# Altium schematic sheet Temp_sensors Input.SchDoc
size A4; SheetNumber: 10; SheetTotal: 16
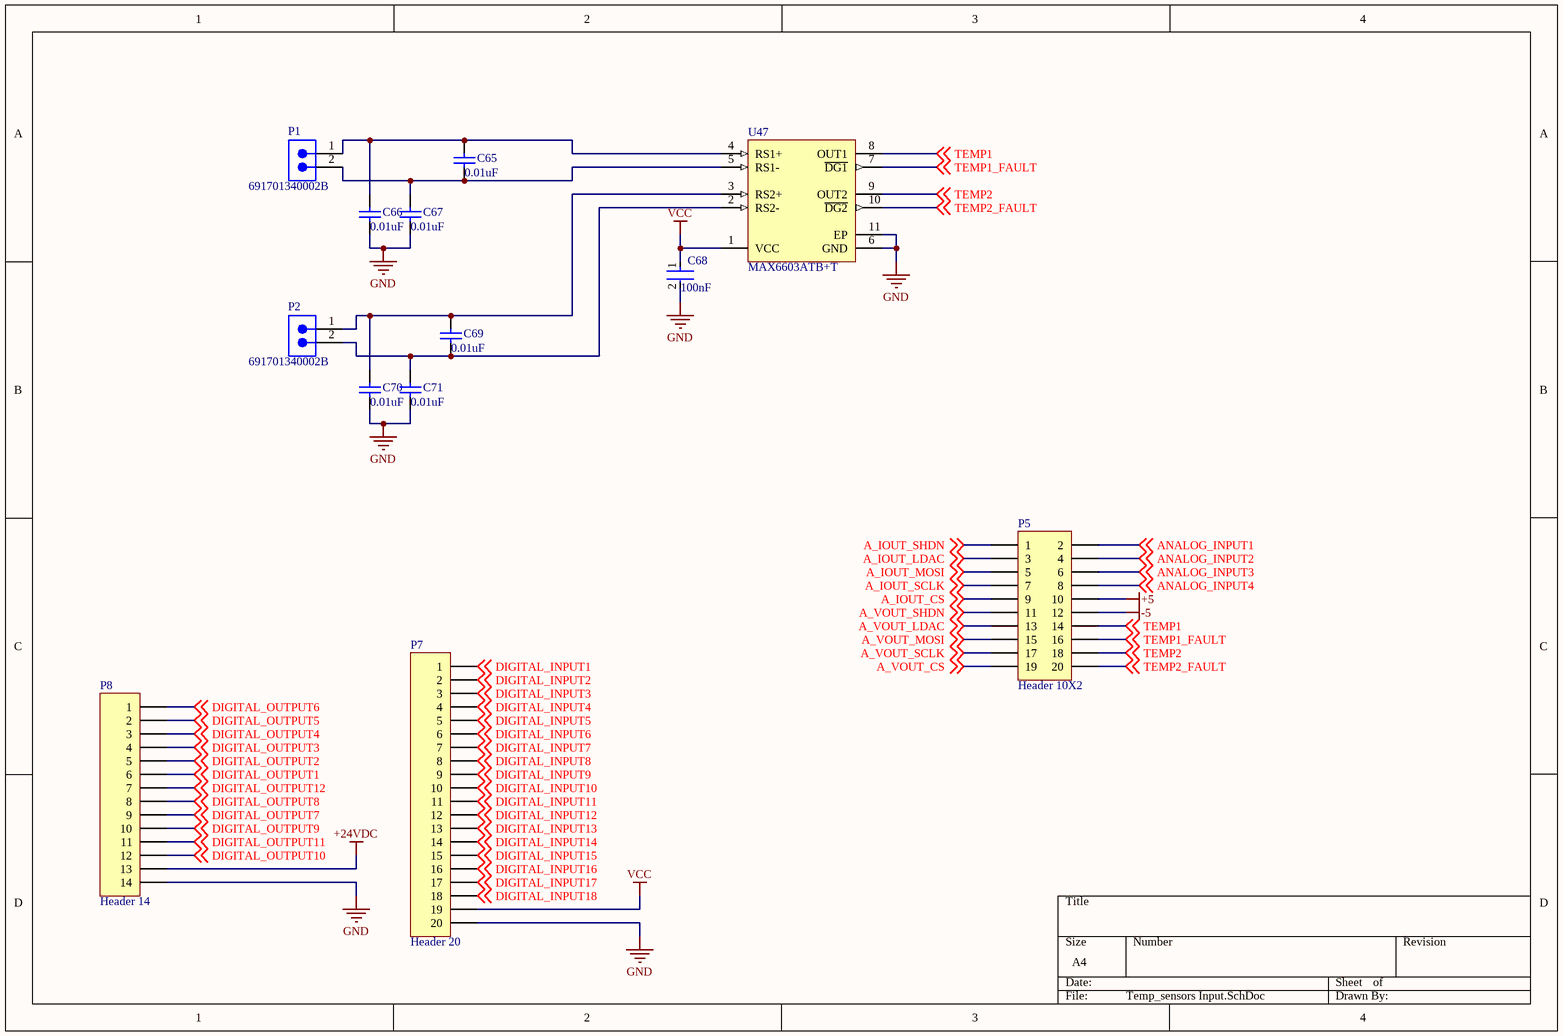
[diagram p0: Temp_sensors Input.SchDoc]

## Parts
C65  value 0.01uF  [CAPC1608X92X38ML15T08]  (hidden comment: VJ0603Y103KXAAP)
C66  value 0.01uF  [CAPC1608X92X38ML15T08]  (hidden comment: VJ0603Y103KXAAP)
C67  value 0.01uF  [CAPC1608X92X38ML15T08]  (hidden comment: VJ0603Y103KXAAP)
C68  Capacitance: 100nF  [FP-0805-L_2_01_0_2-W_1_25-IPC_B]  (hidden comment: 08051C104K4T2A)
C69  value 0.01uF  [CAPC1608X92X38ML15T08]  (hidden comment: VJ0603Y103KXAAP)
C70  value 0.01uF  [CAPC1608X92X38ML15T08]  (hidden comment: VJ0603Y103KXAAP)
C71  value 0.01uF  [CAPC1608X92X38ML15T08]  (hidden comment: VJ0603Y103KXAAP)
P1  691701340002B  [691701340002B]
P2  691701340002B  [691701340002B]
P5  Header 10X2  [HDR2X10]
P7  Header 20  [HDR1X20]
P8  Header 14  [HDR1X14]
U47  MAX6603ATB+T  [MAXM-T1033+1_V]

## Nets
+5: P5.10
+24VDC: P8.13
-5: P5.12
GND: C66.1 C67.1 C68.2 C70.1 C71.1 P7.20 P8.14 U47.6(GND) U47.11(EP)
VCC: C68.1 P7.19 U47.1(VCC)
A_IOUT_CS: P5.9 ; off-sheet A_IOUT_CS
A_IOUT_LDAC: P5.3 ; off-sheet A_IOUT_LDAC
A_IOUT_MOSI: P5.5 ; off-sheet A_IOUT_MOSI
A_IOUT_SCLK: P5.7 ; off-sheet A_IOUT_SCLK
A_IOUT_SHDN: P5.1 ; off-sheet A_IOUT_SHDN
A_VOUT_CS: P5.19 ; off-sheet A_VOUT_CS
A_VOUT_LDAC: P5.13 ; off-sheet A_VOUT_LDAC
A_VOUT_MOSI: P5.15 ; off-sheet A_VOUT_MOSI
A_VOUT_SCLK: P5.17 ; off-sheet A_VOUT_SCLK
A_VOUT_SHDN: P5.11 ; off-sheet A_VOUT_SHDN
ANALOG_INPUT1: P5.2 ; off-sheet ANALOG_INPUT1
ANALOG_INPUT2: P5.4 ; off-sheet ANALOG_INPUT2
ANALOG_INPUT3: P5.6 ; off-sheet ANALOG_INPUT3
ANALOG_INPUT4: P5.8 ; off-sheet ANALOG_INPUT4
DIGITAL_INPUT1: P7.1 ; off-sheet DIGITAL_INPUT1
DIGITAL_INPUT2: P7.2 ; off-sheet DIGITAL_INPUT2
DIGITAL_INPUT3: P7.3 ; off-sheet DIGITAL_INPUT3
DIGITAL_INPUT4: P7.4 ; off-sheet DIGITAL_INPUT4
DIGITAL_INPUT5: P7.5 ; off-sheet DIGITAL_INPUT5
DIGITAL_INPUT6: P7.6 ; off-sheet DIGITAL_INPUT6
DIGITAL_INPUT7: P7.7 ; off-sheet DIGITAL_INPUT7
DIGITAL_INPUT8: P7.8 ; off-sheet DIGITAL_INPUT8
DIGITAL_INPUT9: P7.9 ; off-sheet DIGITAL_INPUT9
DIGITAL_INPUT10: P7.10 ; off-sheet DIGITAL_INPUT10
DIGITAL_INPUT11: P7.11 ; off-sheet DIGITAL_INPUT11
DIGITAL_INPUT12: P7.12 ; off-sheet DIGITAL_INPUT12
DIGITAL_INPUT13: P7.13 ; off-sheet DIGITAL_INPUT13
DIGITAL_INPUT14: P7.14 ; off-sheet DIGITAL_INPUT14
DIGITAL_INPUT15: P7.15 ; off-sheet DIGITAL_INPUT15
DIGITAL_INPUT16: P7.16 ; off-sheet DIGITAL_INPUT16
DIGITAL_INPUT17: P7.17 ; off-sheet DIGITAL_INPUT17
DIGITAL_INPUT18: P7.18 ; off-sheet DIGITAL_INPUT18
DIGITAL_OUTPUT1: P8.6 ; off-sheet DIGITAL_OUTPUT1
DIGITAL_OUTPUT2: P8.5 ; off-sheet DIGITAL_OUTPUT2
DIGITAL_OUTPUT3: P8.4 ; off-sheet DIGITAL_OUTPUT3
DIGITAL_OUTPUT4: P8.3 ; off-sheet DIGITAL_OUTPUT4
DIGITAL_OUTPUT5: P8.2 ; off-sheet DIGITAL_OUTPUT5
DIGITAL_OUTPUT6: P8.1 ; off-sheet DIGITAL_OUTPUT6
DIGITAL_OUTPUT7: P8.9 ; off-sheet DIGITAL_OUTPUT7
DIGITAL_OUTPUT8: P8.8 ; off-sheet DIGITAL_OUTPUT8
DIGITAL_OUTPUT9: P8.10 ; off-sheet DIGITAL_OUTPUT9
DIGITAL_OUTPUT10: P8.12 ; off-sheet DIGITAL_OUTPUT10
DIGITAL_OUTPUT11: P8.11 ; off-sheet DIGITAL_OUTPUT11
DIGITAL_OUTPUT12: P8.7 ; off-sheet DIGITAL_OUTPUT12
TEMP1: P5.14 U47.8(OUT1) ; off-sheet TEMP1
TEMP1_FAULT: P5.16 U47.7(~{DG1}) ; off-sheet TEMP1_FAULT
TEMP2: P5.18 U47.9(OUT2) ; off-sheet TEMP2
TEMP2_FAULT: P5.20 U47.10(~{DG2}) ; off-sheet TEMP2_FAULT
NetC65_1: C65.1 C67.2 P1.2 U47.5(RS1-)
NetC65_2: C65.2 C66.2 P1.1 U47.4(RS1+)
NetC69_1: C69.1 C71.2 P2.2 U47.2(RS2-)
NetC69_2: C69.2 C70.2 P2.1 U47.3(RS2+)

## Library data of the parts
C65-C67 C69-C71 = CMP-2006-01149-1: Manufacturer: Vitramon; Part Number: VJ0603Y103KXAAP
C68 = CMP-2007-04172-2: Automotive Ceramic Capacitor, 0805, 100nF, 10%, X7R, 15%, 100V; Voltage Rating (DC): 100V; Case Code (Metric): 2012; Mount: Surface Mount; Length: 2.01mm; Depth: 1.25mm; Lead Free: Lead Free; Ratings: AEC-Q200; Max Operating Temperature: 125°C; Tolerance: 10%; Case/Package: 0805; Width: 0.049inch; Package Quantity: 1; Thickness: 0.055inch; Construction: Flat; Min Operating Temperature: -55°C; REACH SVHC: No SVHC; Number of Pins: 2; Radiation Hardening: No; Voltage Rating: 100V; Height: 1.4mm; Series: -; Voltage: 100V; Dielectric: X7R; Termination: SMD/SMT; Case Code (Imperial): 0805; RoHS Compliant: Yes; Packaging: Tape and Reel; Dielectric Material: Ceramic
P1 P2 = CMP-1502-02003-2: NexarPartId: 22866719; Number of Contacts: 2; Pitch: 3.81mm; Gender: Male; Voltage Rating: 300V; Connector Type: Terminal Block; Current Rating: 10A; Mount: Through Hole; Length: 9.01mm; Min Operating Temperature: -40°C; RoHS: Compliant; REACH SVHC: Unknown; Max Operating Temperature: 105°C; Contact Plating: Tin; Termination: PCB; Packaging: Tape and Reel; Contact Material: Brass; Contact Gender: Male; Lead Pitch: 3.81mm; Number of Pins: 2; Housing Material: Polymer; Color: Black
P5 = Header 10X2: Header, 10-Pin, Dual row; LatestRevisionDate: 17-Jul-2002; LatestRevisionNote: Re-released for DXP Platform.; Publisher: Altium Limited
P7 = Header 20: Header, 20-Pin; LatestRevisionDate: 17-Jul-2002; LatestRevisionNote: Re-released for DXP Platform.; Publisher: Altium Limited
P8 = Header 14: Header, 14-Pin; LatestRevisionDate: 17-Jul-2002; LatestRevisionNote: Re-released for DXP Platform.; Publisher: Altium Limited
U47 = CMP-0253-00482-1: 2-Channel Platinum RTD-to-Voltage Signal Conditioner, -40 to 125 degC, 10-Pin SON (T1033+1), Pb-Free, Tape and Reel; Parasite Pwr.: No; Functions: RTD to Voltage Signal Conditioner; Interface: Analog; Generic Part Number: MAX6603; Packing: Tape and Reel; ComponentLink1URL: http://www.maximintegrated.com/; ComponentLink3Description: Package Specification; PackageDescription: 10-Pin Plastic Very Very Thin Dual Flatpack No Leads, Exposed Pad (T1033+1), Body 3 x 3 mm, Pitch 0.5 mm; Code_JEDEC: MO229; ComponentLink1Description: Manufacturer URL; PartNumber: MAX6603ATB+T; PackageVersion: Rev. J, 08/2009; DatasheetVersion: Rev. 0; ComponentLink3URL: http://pdfserv.maximintegrated.com/package_dwgs/21-0137.PDF; Mounting Technology: Surface Mount; ComponentLink2URL: http://datasheets.maximintegrated.com/en/ds/MAX6603.pdf; ComponentLink2Description: Datasheet; PackageReference: T1033+1